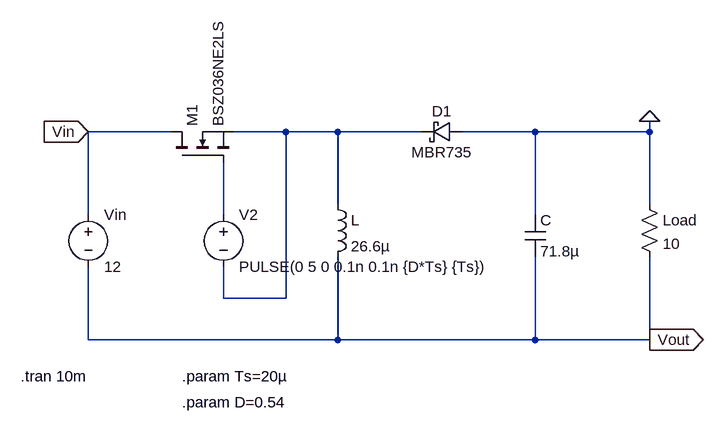
[diagram p0: schematic buck-boost_converter2.asc]
buck-boost_converter2.asc, the LTspice schematic file:
Version 4
SHEET 1 1508 680
WIRE 224 32 96 32
WIRE 400 32 320 32
WIRE 480 32 400 32
WIRE 608 32 480 32
WIRE 784 32 672 32
WIRE 960 32 960 16
WIRE 960 32 784 32
WIRE 480 144 480 32
WIRE 960 144 960 32
WIRE 96 160 96 32
WIRE 304 160 304 80
WIRE 784 160 784 32
WIRE 304 288 304 240
WIRE 400 288 400 32
WIRE 400 288 304 288
WIRE 96 352 96 240
WIRE 480 352 480 224
WIRE 480 352 96 352
WIRE 784 352 784 224
WIRE 784 352 480 352
WIRE 960 352 960 224
WIRE 960 352 784 352
FLAG 960 16 0
FLAG 96 32 Vin
IOPIN 96 32 In
FLAG 960 352 Vout
IOPIN 960 352 Out
SYMBOL voltage 96 144 R0
WINDOW 123 0 0 Left 0
WINDOW 39 0 0 Left 0
SYMATTR InstName Vin
SYMATTR Value 12
SYMBOL ind 464 128 R0
SYMATTR InstName L
SYMATTR Value 26.6µ
SYMBOL cap 768 160 R0
SYMATTR InstName C
SYMATTR Value 71.8µ
SYMBOL res 944 128 R0
SYMATTR InstName Load
SYMATTR Value 10
SYMBOL voltage 304 144 R0
WINDOW 123 0 0 Left 0
WINDOW 39 0 0 Left 0
SYMATTR InstName V2
SYMATTR Value PULSE(0 5 0 0.1n 0.1n {D*Ts} {Ts})
SYMBOL nmos 224 80 R270
SYMATTR InstName M1
SYMATTR Value BSZ036NE2LS
SYMBOL schottky 672 16 R90
WINDOW 0 0 32 VBottom 2
WINDOW 3 32 32 VTop 2
SYMATTR InstName D1
SYMATTR Value MBR735
TEXT -8 408 Left 2 !.tran 10m
TEXT 240 408 Left 2 !.param Ts=20µ
TEXT 240 448 Left 2 !.param D=0.54

The netlist it stands for:
* buck-boost_converter2.asc
Vin Vin Vout 12
L N001 Vout 26.6µ
C 0 Vout 71.8µ
R§Load 0 Vout 10
V2 N002 N001 PULSE(0 5 0 0.1n 0.1n {D*Ts} {Ts})
M1 Vin N002 N001 N001 BSZ036NE2LS
D1 0 N001 MBR735
.model D D
.lib standard.dio
.model NMOS NMOS
.model PMOS PMOS
.lib standard.mos
.tran 10m
.param Ts=20µ
.param D=0.54
.backanno
.end